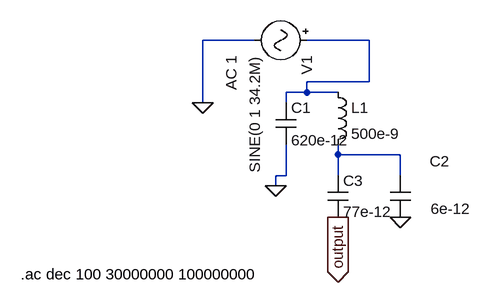
[diagram p0: schematic resonance circuit.asc]
resonance circuit.asc, the LTspice schematic file:
Version 4
SHEET 1 880 680
WIRE -96 48 -176 48
WIRE 80 48 -16 48
WIRE 80 112 80 48
WIRE 80 112 -16 112
WIRE -16 128 -16 112
WIRE -16 128 -48 128
WIRE 32 128 -16 128
WIRE -176 144 -176 48
WIRE -48 144 -48 128
WIRE 32 224 32 208
WIRE 128 224 32 224
WIRE -48 256 -48 208
WIRE -48 256 -64 256
WIRE 32 256 32 224
WIRE 128 256 128 224
WIRE -64 272 -64 256
FLAG 128 320 0
FLAG -64 272 0
FLAG -176 144 0
FLAG 32 320 output
IOPIN 32 320 Out
SYMBOL cap -64 144 R0
WINDOW 3 24 58 Left 2
SYMATTR Value 620e-12
SYMATTR InstName C1
SYMBOL ind 16 112 R0
SYMATTR InstName L1
SYMATTR Value 500e-9
SYMATTR SpiceLine Rpar=0
SYMBOL signal 0 48 R90
WINDOW 123 24 132 Left 2
WINDOW 39 0 0 Left 0
SYMATTR Value2 AC 1
SYMATTR InstName V1
SYMATTR Value SINE(0 1 34.2M)
SYMBOL cap 112 256 R0
WINDOW 0 61 -22 Left 2
WINDOW 3 63 51 Left 2
SYMATTR InstName C2
SYMATTR Value 6e-12
SYMATTR SpiceLine Rser=0
SYMBOL cap 16 256 R0
SYMATTR InstName C3
SYMATTR Value 77e-12
TEXT -456 408 Left 2 !.ac dec 100 30000000 100000000

The netlist it stands for:
* resonance circuit.asc
C1 N001 0 620e-12
L1 N001 N002 500e-9 Rpar=0
V1 N001 0 SINE(0 1 34.2M) AC 1
C2 N002 0 6e-12 Rser=0
C3 N002 output 77e-12
.ac dec 100 30000000 100000000
.backanno
.end